# Altium project ControllerPCB.PrjPcb (part 1 of 2)
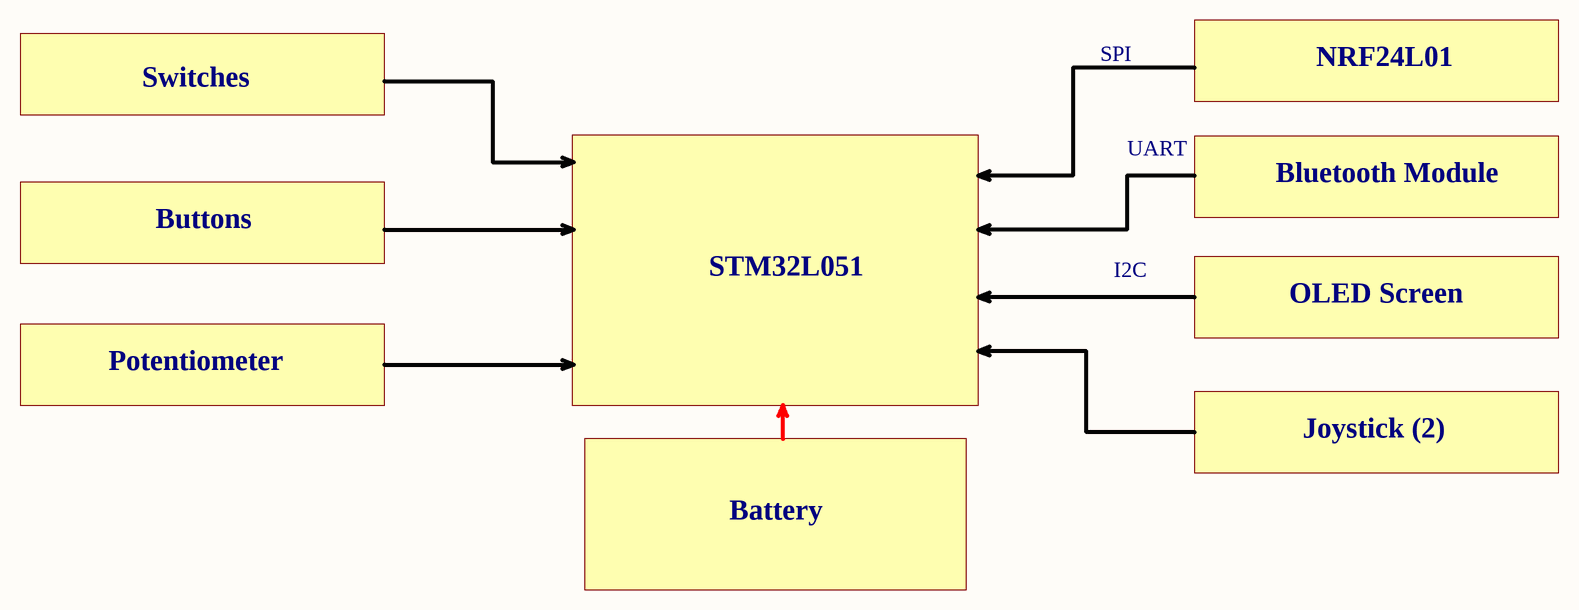
[diagram p0: Blok Diagram.SchDoc]
4 sheets, 79 parts. Net scope: flat (ports and power ports of the same name join across sheets).
Board files: ControllerPCB.PcbDoc, ControllerPCB2.PcbDoc
Sheets:
  Blok Diagram.SchDoc
  MCU.SchDoc
  Peripheral.SchDoc
  Power.SchDoc

## Sheet Blok Diagram.SchDoc
size A3; Date: 01/12/2021; DrawnBy: Can Güveren; Engineer: Can; SheetNumber: 1; SheetTotal: 4; PageSize: A3

### Notes on the sheet
- Switches
- SPI
- NRF24L01
- UART
- Buttons
- Bluetooth Module
- STM32L051
- I2C
- OLED Screen
- Potentiometer
- Joystick (2)
- Battery
- Project Name
- Draw By
- Date
- Size
- Number

## Sheet MCU.SchDoc
size A3; Date: 01/12/2021; DrawnBy: Can Güveren; SheetNumber: 2; SheetTotal: 4; PageSize: A3
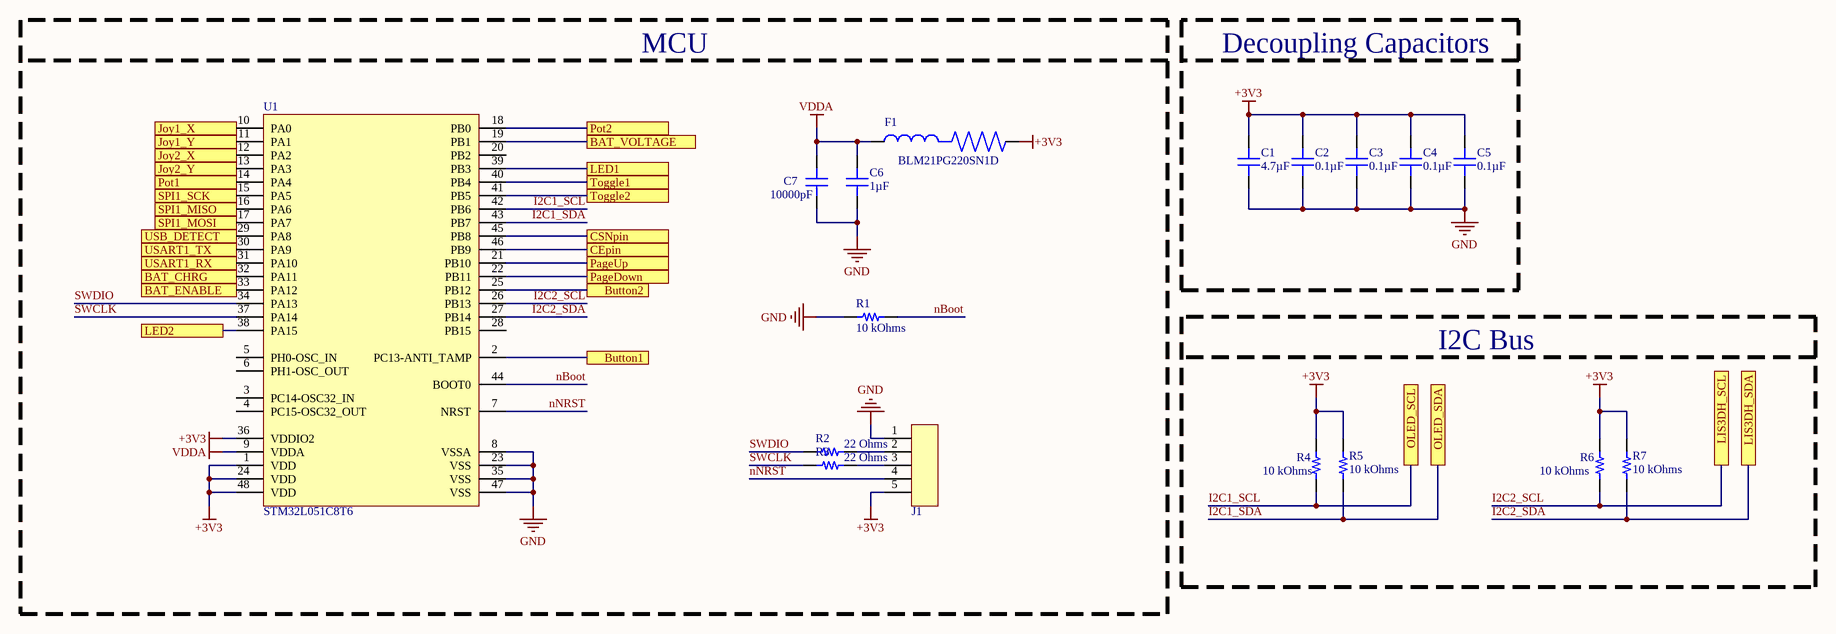
[diagram p1: MCU.SchDoc]

### Parts
C1  4.7µF  [CAP 0603_1608]
C2  0.1µF  [CAP 0603_1608]
C3  0.1µF  [CAP 0603_1608]
C4  0.1µF  [CAP 0603_1608]
C5  0.1µF  [CAP 0603_1608]
C6  1µF  [CAP 0603_1608]
C7  10000pF  [CAP 0603_1608]
F1  BLM21PG220SN1D  [BLM21PG220SN1D]
J1  Header-90 Degree-5x1  [Header-90 Degree-5P]  (value not drawn)
R1  10 kOhms  [RES 0603_1608]
R2  22 Ohms  [RES 0603_1608]
R3  22 Ohms  [RES 0603_1608]
R4  10 kOhms  [RES 0603_1608]
R5  10 kOhms  [RES 0603_1608]
R6  10 kOhms  [RES 0603_1608]
R7  10 kOhms  [RES 0603_1608]
U1  STM32L051C8T6  [LQFP-48]

### Blocks framed on the sheet
MCU: C6 C7 F1 J1 R1-R3 U1
Decoupling Capacitors: C1-C5
I2C Bus: R4-R7

### Ports
BAT_CHRG, BAT_ENABLE, BAT_VOLTAGE, Button1, Button2, CEpin, CSNpin, Joy1_X, Joy1_Y, Joy2_X, Joy2_Y, LED1, LED2, LIS3DH_SCL, LIS3DH_SDA, OLED_SCL, OLED_SDA, PageDown, PageUp, Pot1, Pot2, SPI1_MISO, SPI1_MOSI, SPI1_SCK, Toggle1, Toggle2, USART1_RX, USART1_TX, USB_DETECT

### Nets
+3V3: C1.2 C2.2 C3.2 C4.2 C5.2 F1.2 J1.5 R4.2 R5.2 R6.2 R7.2 U1.1(VDD) U1.24(VDD) U1.36(VDDIO2) U1.48(VDD)  [project net V_Output]
GND: C1.1 C2.1 C3.1 C4.1 C5.1 C6.1 C7.1 J1.1 R1.1 U1.8(VSSA) U1.23(VSS) U1.35(VSS) U1.47(VSS)
VDDA: C6.2 C7.2 F1.1 U1.9(VDDA)
I2C1_SCL: R4.1 U1.42(PB6) ; port OLED_SCL
I2C1_SDA: R5.1 U1.43(PB7) ; port OLED_SDA
I2C2_SCL: R6.1 U1.26(PB13) ; port LIS3DH_SCL
I2C2_SDA: R7.1 U1.27(PB14) ; port LIS3DH_SDA
nBoot: R1.2 U1.44(BOOT0)
nNRST: J1.4 U1.7(NRST)
SWCLK: R3.1 U1.37(PA14)
SWDIO: R2.1 U1.34(PA13)
NetC8_2: U1.21(PB10) ; port PageUp
NetC10_2: U1.22(PB11) ; port PageDown
NetC16_2: U1.29(PA8) ; port USB_DETECT
NetC19_2: U1.19(PB1) ; port BAT_VOLTAGE
NetH1_2: U1.31(PA10) ; port USART1_RX
NetH1_3: U1.30(PA9) ; port USART1_TX
NetJ1_2: J1.2 R2.2
NetJ1_3: J1.3 R3.2
NetJ2_H2: U1.11(PA1) ; port Joy1_Y
NetJ2_V2: U1.10(PA0) ; port Joy1_X
NetJ3_H2: U1.13(PA3) ; port Joy2_Y
NetJ3_V2: U1.12(PA2) ; port Joy2_X
NetR14_1: U1.39(PB3) ; port LED1
NetR15_1: U1.38(PA15) ; port LED2
NetR16_1: U1.32(PA11) ; port BAT_CHRG
NetR19_1: U1.33(PA12) ; port BAT_ENABLE
NetR28_1: U1.2(PC13-ANTI_TAMP) ; port Button1
NetR29_1: U1.25(PB12) ; port Button2
NetS1_2: U1.40(PB4) ; port Toggle1
NetS2_2: U1.41(PB5) ; port Toggle2
NetU1_14: U1.14(PA4) ; port Pot1
NetU1_15: U1.15(PA5) ; port SPI1_SCK
NetU1_16: U1.16(PA6) ; port SPI1_MISO
NetU1_17: U1.17(PA7) ; port SPI1_MOSI
NetU1_18: U1.18(PB0) ; port Pot2
NetU1_45: U1.45(PB8) ; port CSNpin
NetU1_46: U1.46(PB9) ; port CEpin

Not connected (* = marked no-connect by the designer): U1 3(PC14-OSC32_IN) 4(PC15-OSC32_OUT) 5(PH0-OSC_IN) 6(PH1-OSC_OUT) 20(PB2) 28(PB15)

### Notes on the sheet
- Project Name
- Draw By
- Date
- Size
- Number

### Library data of the parts
C1 = LMK107BJ475KA-T: CAP CER 4.7UF 10V X5R 0603; Manufacturer: Taiyo Yuden; Tolerance: ±10%; Part Number: LMK107BJ475KA-T; Value: 4.7µF; Applications: General Purpose; Capacitance: 4.7µF; ComponentLink1Description: Datasheet; ComponentLink1URL: https://ds.yuden.co.jp/TYCOMPAS/ut/detail?pn=LMK107BJ475KA-T  &u=M; ComponentLink2Description: DigiKey Link; ComponentLink2URL: http://digikey.com/product-detail/en/taiyo-yuden/LMK107BJ475KA-T/587-1441-1-ND/1004072; Device Package: 0603 (1608 Metric); LastUpdated: 2.09.2020 01:03:36; Lifecycle Status: Active; Minimum Order: 1; Mounting Type: Surface Mount, MLCC; Operating Temperature: -55°C ~ 85°C; Package / Case: 0603 (1608 Metric); Packaging: TapeAndReel; PartId: 2244; Part Status: Active; Price: 0.03; Series: M; Size / Dimension: 0.063" L x 0.031" W (1.60mm x 0.80mm); Supplier 1: DigiKey; Supplier Part Number 1: 587-1441-1-ND; Temperature Coefficient: X5R; Thickness (Max): 0.035" (0.90mm); Voltage - Rated: 10V
C2-C5 = 0603Y0160104KXT: CAP CER 0.10UF 16V X7R 0603; Manufacturer: Knowles Syfer; Temperature Coefficient: X7R (2R1); Tolerance: ±10%; Part Number: 0603Y0160104KXT; Value: 0.1µF; Applications: High Reliability, Boardflex Sensitive; Capacitance: 0.1µF; ComponentLink1Description: Datasheet; ComponentLink1URL: https://www.knowlescapacitors.com/getattachment/2dbfc8bc-e2b3-4b4d-afb1-43b011b9ebe0/High-Std-Voltage.aspx; ComponentLink2Description: DigiKey Link; ComponentLink2URL: http://digikey.com/product-detail/en/knowles-syfer/0603Y0160104KXT/1608-1363-1-ND/7644465; Device Package: 0603 (1608 Metric); Features: Soft Termination, High Temperature; LastUpdated: 2.09.2020 01:03:34; Lifecycle Status: Active; Minimum Order: 1; Mounting Type: Surface Mount, MLCC; Operating Temperature: -55°C ~ 125°C; Package / Case: 0603 (1608 Metric); Packaging: TapeAndReel; PartId: 2921; Part Status: Active; Price: 0.16; Series: FlexiCap™; Size / Dimension: 0.063" L x 0.031" W (1.60mm x 0.80mm); Supplier 1: DigiKey; Supplier Part Number 1: 1608-1363-1-ND; Thickness (Max): 0.031" (0.80mm); Voltage - Rated: 16V
C6 = C0603C105K4RACAUTO: CAP CER 0603 1UF 16V X7R 10%; Manufacturer: KEMET; Part Number: C0603C105K4RACAUTO; Value: 1µF; Applications: Automotive, Bypass, Decoupling; Capacitance: 1µF; ComponentLink1Description: Datasheet; ComponentLink1URL: https://api.kemet.com/component-edge/download/datasheet/C0603C105K4RACAUTO.pdf; ComponentLink2Description: DigiKey Link; ComponentLink2URL: http://digikey.com/product-detail/en/kemet/C0603C105K4RACAUTO/399-17704-1-ND/8635855; Device Package: 0603 (1608 Metric); LastUpdated: 2.09.2020 01:03:36; Lifecycle Status: Active; Minimum Order: 1; Mounting Type: Surface Mount, MLCC; Operating Temperature: -55°C ~ 125°C; Package / Case: 0603 (1608 Metric); Packaging: TapeAndReel; PartId: 2179; Part Status: Active; Price: 0.02; Ratings: AEC-Q200; Series: SMD Auto X7R; Size / Dimension: 0.063" L x 0.031" W (1.60mm x 0.80mm); Supplier 1: DigiKey; Supplier Part Number 1: 399-17704-1-ND; Temperature Coefficient: X7R; Thickness (Max): 0.037" (0.95mm); Tolerance: ±10%; Voltage - Rated: 16V
C7 = C0603C103K4RECAUTO: CAP CER 0603 10NF 16V X7R 10%; Manufacturer: KEMET; Part Number: C0603C103K4RECAUTO; Value: 10000pF; Applications: Automotive, ESD Protection; Capacitance: 10000pF; ComponentLink1Description: Datasheet; ComponentLink1URL: https://api.kemet.com/component-edge/download/datasheet/C0603C103K4RECAUTO.pdf; ComponentLink2Description: DigiKey Link; ComponentLink2URL: http://digikey.com/product-detail/en/kemet/C0603C103K4RECAUTO/399-17880-1-ND/8640547; Device Package: 0603 (1608 Metric); LastUpdated: 2.09.2020 01:03:25; Lifecycle Status: Active; Minimum Order: 1; Mounting Type: Surface Mount, MLCC; Operating Temperature: -55°C ~ 125°C; Package / Case: 0603 (1608 Metric); Packaging: TapeAndReel; PartId: 8251; Part Status: Active; Price: 0.02; Ratings: AEC-Q200; Series: ESD SMD Auto X7R; Size / Dimension: 0.063" L x 0.031" W (1.60mm x 0.80mm); Supplier 1: DigiKey; Supplier Part Number 1: 399-17880-1-ND; Temperature Coefficient: X7R; Thickness (Max): 0.034" (0.87mm); Tolerance: ±10%; Voltage - Rated: 16V
F1 = BLM21PG220SN1D: Ferrite Beads Multi-Layer 22Ohm 25% 100MHz 6A 9mOhm DCR 0805 Paper T/R; Manufacturer: Murata; Manufacturer Series: BLM21P; Material: Steel,Ferrite; Impedance: 22R; DC Resistance (DCR): 9mR; Shielding: Unshielded; Number of Circuits: 1; Resistance: 10mR; Supplier 1: Digi-Key; Manufacturer Part Number: BLM21PG220SN1D; RoHS: Yes; Category: Ferrite Beads and Chips; Pricing 1: 1=0,13000, 10=0,10300, 25=0,09320, 50=0,06820, 100=0,05890, 250=0,04652, 500=0,03930, 1000=0,03309 (USD); Case/Package: 0805; Number of Pins: 2; Core Material: Ferrite; Case Code (Metric): 2012; Case Code (Imperial): 0805; Weight: 0.000194oz; Terminal Finish: Tin; Min Operating Temperature: -55°C; Max Operating Temperature: 125°C; Tolerance: 25%; Packaging: Tape and Reel; Current Rating: 6A; Max DC Current: 6A; Number of Lines: 1; Package Quantity: 1; Max Current Rating: 6A; Termination: SMD/SMT; Test Frequency: 100MHz; DC Current: 6A; Series: BLM21P; DC Resistance-Max: 9mR; Number of Functions: 1; Length: 2mm; Width: 1.25mm; Height: 0.85mm; Depth: 1.25mm; Radiation Hardening: No; REACH SVHC: No SVHC; Lead Free: Lead Free; RoHS Compliant: Yes; ComponentLink1URL: https://datasheet.ciiva.com/14122/anblm21p-data-e-14122211.pdf?src-supplier=Distrelec; ComponentLink1Description: https://datasheet.ciiva.com/14122/anblm21p-data-e-14122211.pdf?src-supplier=Distrelec; ComponentLink2URL: https://datasheet.ciiva.com/11799/0900766b81275e31-11799177.pdf?src-supplier=RSComponents; ComponentLink2Description: https://datasheet.ciiva.com/11799/0900766b81275e31-11799177.pdf?src-supplier=RSComponents; ComponentLink3URL: https://datasheet.ciiva.com/29700/1845312-29700540.pdf?src-supplier=Jameco; ComponentLink3Description: https://datasheet.ciiva.com/29700/1845312-29700540.pdf?src-supplier=Jameco; ComponentLink4URL: https://datasheet.ciiva.com/3081/l0110s0100blm21p-3081653.pdf?src-supplier=Avnet; ComponentLink4Description: https://datasheet.ciiva.com/3081/l0110s0100blm21p-3081653.pdf?src-supplier=Avnet; ComponentLink5URL: https://datasheet.ciiva.com/8021/5160-8021589.pdf?src-supplier=Element14; ComponentLink5Description: https://datasheet.ciiva.com/8021/5160-8021589.pdf?src-supplier=Element14; ComponentLink6URL: https://datasheet.ciiva.com/16291/l0110s0100blm21p-16291622.pdf?src-supplier=Future+Electronics; ComponentLink6Description: https://datasheet.ciiva.com/16291/l0110s0100blm21p-16291622.pdf?src-supplier=Future+Electronics; ComponentLink7URL: https://datasheet.ciiva.com/8021/5160-8021591.pdf?src-supplier=Element14; ComponentLink7Description: https://datasheet.ciiva.com/8021/5160-8021591.pdf?src-supplier=Element14; ComponentLink8URL: https://datasheet.ciiva.com/6211/l0110s0100blm21p-6211741.pdf?src-supplier=Digi-Key; ComponentLink8Description: https://datasheet.ciiva.com/6211/l0110s0100blm21p-6211741.pdf?src-supplier=Digi-Key; ComponentLink9URL: https://datasheet.ciiva.com/41449/001171738-da-01-en-chip-drossel0805-22r0-6000ma-2-0x1-25mm-41449366.pdf?src-supplier=Conrad; ComponentLink9Description: https://datasheet.ciiva.com/41449/001171738-da-01-en-chip-drossel0805-22r0-6000ma-2-0x1-25mm-41449366.pdf?src-supplier=Conrad; Supplier Part Number 1: 490-5987-6-ND
R1 R4-R7 = RNCS0603BKE10K0: RES 10K OHM 0.1% 1/16W 0603; Manufacturer: Stackpole Electronics Inc; Power (Watts): 0.063W, 1/16W; Temperature Coefficient: ±25ppm/°C; Part Number: RNCS0603BKE10K0; Value: 10 kOhms; ComponentLink1Description: Datasheet; ComponentLink1URL: https://www.seielect.com/catalog/sei-rncs_rnch.pdf; ComponentLink2Description: DigiKey Link; ComponentLink2URL: http://digikey.com/product-detail/en/stackpole-electronics-inc/RNCS0603BKE10K0/RNCS0603BKE10K0CT-ND/1800113; Composition: Thin Film; Device Package: 0603 (1608 Metric); Features: Anti-Corrosive, Automotive AEC-Q200, Moisture Resistant; Height - Seated (Max): 0.022" (0.55mm); LastUpdated: 2.09.2020 01:10:25; Lifecycle Status: Active; Minimum Order: 1; Number of Terminations: 2; Operating Temperature: -55°C ~ 155°C; Package / Case: 0603 (1608 Metric); Packaging: TapeAndReel; PartId: 4838; Part Status: Active; Price: 0.08; Ratings: AEC-Q200; Resistance: 10 kOhms; Series: RNCS; Size / Dimension: 0.061" L x 0.031" W (1.55mm x 0.80mm); Supplier 1: DigiKey; Supplier Part Number 1: RNCS0603BKE10K0CT-ND; Supplier Device Package: 0603; Tolerance: ±0.1%
R2 R3 = ERJ-3EKF22R0V: RES SMD 22 OHM 1% 1/10W 0603; Manufacturer: Panasonic Electronic Components; Power (Watts): 0.1W, 1/10W; Temperature Coefficient: ±100ppm/°C; Part Number: ERJ-3EKF22R0V; Value: 22 Ohms; ComponentLink1Description: Datasheet; ComponentLink1URL: https://industrial.panasonic.com/cdbs/www-data/pdf/RDA0000/AOA0000C304.pdf; ComponentLink2Description: DigiKey Link; ComponentLink2URL: http://digikey.com/product-detail/en/panasonic-electronic-components/ERJ-3EKF22R0V/P22.0HCT-ND/1746745; Composition: Thick Film; Device Package: 0603 (1608 Metric); Features: Automotive AEC-Q200; Height - Seated (Max): 0.022" (0.55mm); LastUpdated: 2.09.2020 01:10:23; Lifecycle Status: Active; Minimum Order: 1; Number of Terminations: 2; Operating Temperature: -55°C ~ 155°C; Package / Case: 0603 (1608 Metric); Packaging: TapeAndReel; PartId: 5655; Part Status: Active; Price: 0.01; Ratings: AEC-Q200; Resistance: 22 Ohms; Series: ERJ; Size / Dimension: 0.063" L x 0.031" W (1.60mm x 0.80mm); Supplier 1: DigiKey; Supplier Part Number 1: P22.0HCT-ND; Supplier Device Package: 0603; Tolerance: ±1%
U1 = STM32L051C8T6: MCU 32-Bit Ultra Low Power STM32L ARM Cortex M0+ RISC 64kB Flash 48-Pin LQFP Tray; Manufacturer: STMicroelectronics; Max Power Dissipation: 363mW; Interface: I2C,SPI,IrDA,UART,USART,I2S; Number of I/Os: 37; Number of Timers/Counters: 5; RAM Size: 8KB; Frequency: 32MHz; Oscillator Type: Internal; Max Supply Voltage: 3.6V; Data Bus Width: 32b; Watchdog Timer: Yes; Peripherals: Brown-out Detect/Reset,POR,PWM,WDT,DMA; Supplier 1: Digi-Key; Manufacturer Part Number: STM32L051C8T6; RoHS: Yes; Category: Microcontrollers; Pricing 1: 1=4,40000, 10=3,95400, 25=3,73840, 80=3,24000, 250=3,07380, 500=2,76920 (USD); Case/Package: LQFP; Number of Pins: 48; Min Operating Temperature: -40°C; Max Operating Temperature: 85°C; Packaging: Tray; Number of Programmable I/O: 37; Max Frequency: 32MHz; Memory Type: FLASH; Memory Size: 64KB; Core Architecture: ARM; REACH SVHC: No SVHC; Lead Free: Lead Free; RoHS Compliant: Yes; ComponentLink1URL: https://datasheet.ciiva.com/48492/dm00108219-48492460.pdf?src-supplier=Avnet; ComponentLink1Description: https://datasheet.ciiva.com/48492/dm00108219-48492460.pdf?src-supplier=Avnet; Supplier Part Number 1: 497-14900-ND

## Sheet Peripheral.SchDoc
size A3; Date: 01/12/2021; DrawnBy: Can Güveren; SheetNumber: 3; SheetTotal: 4; PageSize: A3
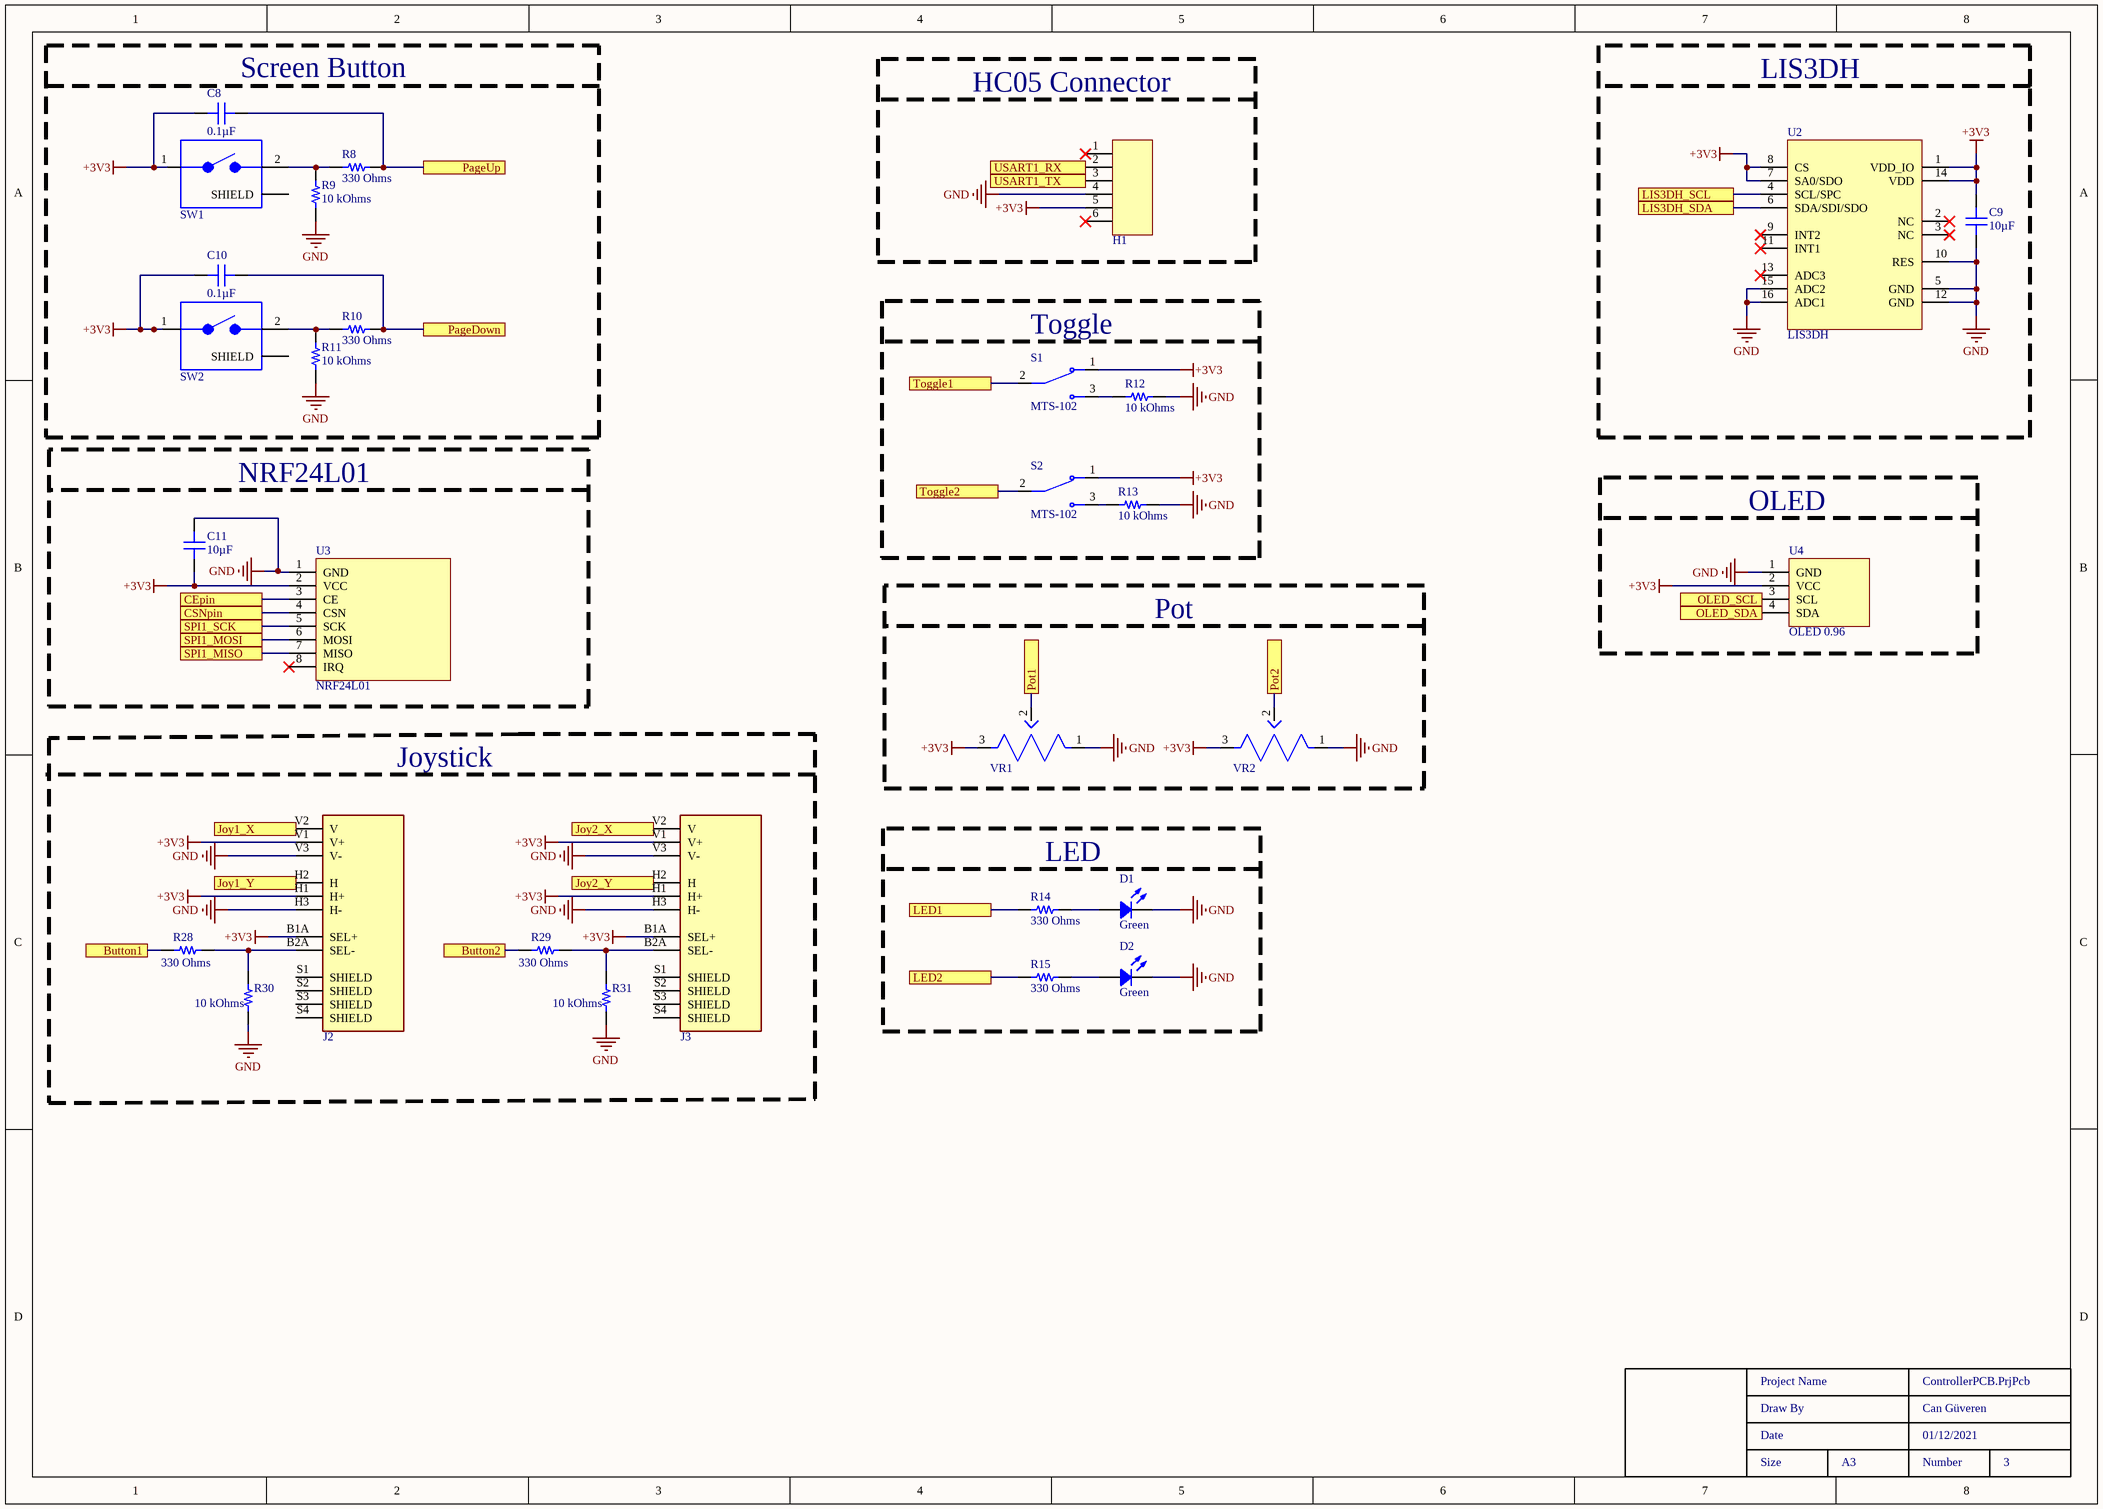
[diagram p2: Peripheral.SchDoc]

### Parts
C8  0.1µF  [CAP 0603_1608]
C9  10µF  [CAP 0603_1608]
C10  0.1µF  [CAP 0603_1608]
C11  10µF  [CAP 0603_1608]
D1  Green  [LED 1206_3216 YELLOW]
D2  Green  [LED 1206_3216 YELLOW]
H1  1x6 Pin Header - Female  [1x6 Pin Header - Female]  (value not drawn)
J2  COM-09032  [COM-09032]  (value not drawn)
J3  COM-09032  [COM-09032]  (value not drawn)
R8  330 Ohms  [RES 0603_1608]
R9  10 kOhms  [RES 0603_1608]
R10  330 Ohms  [RES 0603_1608]
R11  10 kOhms  [RES 0603_1608]
R12  10 kOhms  [RES 0603_1608]
R13  10 kOhms  [RES 0603_1608]
R14  330 Ohms  [RES 0603_1608]
R15  330 Ohms  [RES 0603_1608]
R28  330 Ohms  [RES 0603_1608]
R29  330 Ohms  [RES 0603_1608]
R30  10 kOhms  [RES 0603_1608]
R31  10 kOhms  [RES 0603_1608]
S1  MTS-102  [MTS-102 (Toggle)]
S2  MTS-102  [MTS-102 (Toggle)]
SW1  Switch Tactile, Right Angle  [Tactile Switch]  (value not drawn)
SW2  Switch Tactile, Right Angle  [Tactile Switch]  (value not drawn)
U2  LIS3DH  [VFLGA-16]
U3  NRF24L01  [NRF24L01+ PCB]
U4  OLED 0.96  [OLED 0.96]
VR1  PTV09A-4225F-B104  [PTV09A-4225F-B104]  (value not drawn)
VR2  PTV09A-4225F-B104  [PTV09A-4225F-B104]  (value not drawn)

### Blocks framed on the sheet
Screen Button: C8 C10 R8-R11 SW1 SW2
HC05 Connector: H1
LIS3DH: C9 U2
Toggle: R12 R13 S1 S2
NRF24L01: C11 U3
OLED: U4
Pot: VR1 VR2
Joystick: J2 J3 R28-R31
LED: D1 D2 R14 R15

### Ports
Button1, Button2, CEpin, CSNpin, Joy1_X, Joy1_Y, Joy2_X, Joy2_Y, LED1, LED2, LIS3DH_SCL, LIS3DH_SDA, OLED_SCL, OLED_SDA, PageDown, PageUp, Pot1, Pot2, SPI1_MISO, SPI1_MOSI, SPI1_SCK, Toggle1, Toggle2, USART1_RX, USART1_TX

### Nets
+3V3: C8.1 C9.2 C10.1 C11.1 H1.5 J2.B1A(SEL+) J2.H1(H+) J2.V1(V+) J3.B1A(SEL+) J3.H1(H+) J3.V1(V+) S1.1 S2.1 SW1.1 SW2.1 U2.1(VDD_IO) U2.7(SA0/SDO) U2.8(CS) U2.14(VDD) U3.2(VCC) U4.2(VCC) VR1.3 VR2.3  [project net V_Output]
GND: C9.1 C11.2 D1.2 D2.2 H1.4 J2.H3(H-) J2.V3(V-) J3.H3(H-) J3.V3(V-) R9.1 R11.1 R12.1 R13.1 R30.1 R31.1 U2.5(GND) U2.10(RES) U2.12(GND) U2.15(ADC2) U2.16(ADC1) U3.1(GND) U4.1(GND) VR1.1 VR2.1
I2C1_SCL: U4.3(SCL) ; port OLED_SCL
I2C1_SDA: U4.4(SDA) ; port OLED_SDA
I2C2_SCL: U2.4(SCL/SPC) ; port LIS3DH_SCL
I2C2_SDA: U2.6(SDA/SDI/SDO) ; port LIS3DH_SDA
NetC8_2: C8.2 R8.2 ; port PageUp
NetC10_2: C10.2 R10.2 ; port PageDown
NetD1_1: D1.1 R14.2
NetD2_1: D2.1 R15.2
NetH1_2: H1.2 ; port USART1_RX
NetH1_3: H1.3 ; port USART1_TX
NetJ2_B2A: J2.B2A(SEL-) R28.2 R30.2
NetJ2_H2: J2.H2(H) ; port Joy1_Y
NetJ2_V2: J2.V2(V) ; port Joy1_X
NetJ3_B2A: J3.B2A(SEL-) R29.2 R31.2
NetJ3_H2: J3.H2(H) ; port Joy2_Y
NetJ3_V2: J3.V2(V) ; port Joy2_X
NetR8_1: R8.1 R9.2 SW1.2
NetR10_1: R10.1 R11.2 SW2.2
NetR12_2: R12.2 S1.3
NetR13_2: R13.2 S2.3
NetR14_1: R14.1 ; port LED1
NetR15_1: R15.1 ; port LED2
NetR28_1: R28.1 ; port Button1
NetR29_1: R29.1 ; port Button2
NetS1_2: S1.2 ; port Toggle1
NetS2_2: S2.2 ; port Toggle2
NetSW1_S1: SW1.S1(SHIELD) SW1.S2(SHIELD)
NetSW2_S1: SW2.S1(SHIELD) SW2.S2(SHIELD)
NetU1_14: VR1.2 ; port Pot1
NetU1_15: U3.5(SCK) ; port SPI1_SCK
NetU1_16: U3.7(MISO) ; port SPI1_MISO
NetU1_17: U3.6(MOSI) ; port SPI1_MOSI
NetU1_18: VR2.2 ; port Pot2
NetU1_45: U3.4(CSN) ; port CSNpin
NetU1_46: U3.3(CE) ; port CEpin

Not connected (* = marked no-connect by the designer): H1 1(0)* 6(5)*; J2 S1(SHIELD) S2(SHIELD) S3(SHIELD) S4(SHIELD); J3 S1(SHIELD) S2(SHIELD) S3(SHIELD) S4(SHIELD); U2 2(NC)* 3(NC)* 9(INT2)* 11(INT1)* 13(ADC3)*; U3 8(IRQ)*

### Notes on the sheet
- Project Name
- Draw By
- Date
- Size
- Number

### Library data of the parts
C8 C10 = C0603C104K5RAC7411: CAP CER 0.1UF 50V X7R 0603; Manufacturer: KEMET; Tolerance: ±10%; Part Number: C0603C104K5RAC7411; Value: 0.1µF; Applications: Bypass, Decoupling; Capacitance: 0.1µF; ComponentLink1Description: Datasheet; ComponentLink1URL: https://api.kemet.com/component-edge/download/datasheet/C0603C104K5RAC7411.pdf; ComponentLink2Description: DigiKey Link; ComponentLink2URL: http://digikey.com/product-detail/en/kemet/C0603C104K5RAC7411/399-7374-2-ND/3317013; Device Package: 0603 (1608 Metric); LastUpdated: 2.09.2020 01:03:36; Lifecycle Status: Active; Minimum Order: 15000; Mounting Type: Surface Mount, MLCC; Operating Temperature: -55°C ~ 125°C; Package / Case: 0603 (1608 Metric); Packaging: TapeAndReel; PartId: 2233; Part Status: Active; Price: 0.02; Series: SMD Comm X7R; Size / Dimension: 0.063" L x 0.031" W (1.60mm x 0.80mm); Supplier 1: DigiKey; Supplier Part Number 1: 399-7374-2-ND; Temperature Coefficient: X7R; Thickness (Max): 0.035" (0.90mm); Voltage - Rated: 50V
C9 C11 = GRM188R60J106ME47D: CAP CER 10UF 6.3V X5R 0603; Manufacturer: Murata Electronics; Tolerance: ±20%; Part Number: GRM188R60J106ME47D; Value: 10µF; Applications: General Purpose; Capacitance: 10µF; ComponentLink1Description: Datasheet; ComponentLink1URL: https://www.murata.com/~/media/webrenewal/support/library/catalog/products/capacitor/mlcc/c02e.ashx?la=en-us; ComponentLink2Description: DigiKey Link; ComponentLink2URL: http://digikey.com/product-detail/en/murata-electronics/GRM188R60J106ME47D/490-3896-1-ND/965938; Device Package: 0603 (1608 Metric); LastUpdated: 2.09.2020 01:03:35; Lifecycle Status: Active; Minimum Order: 1; Mounting Type: Surface Mount, MLCC; Operating Temperature: -55°C ~ 85°C; Package / Case: 0603 (1608 Metric); Packaging: TapeAndReel; PartId: 2351; Part Status: Active; Price: 0.03; Series: GRM; Size / Dimension: 0.063" L x 0.031" W (1.60mm x 0.80mm); Supplier 1: DigiKey; Supplier Part Number 1: 490-3896-1-ND; Temperature Coefficient: X5R; Thickness (Max): 0.035" (0.90mm); Voltage - Rated: 6.3V
D1 D2 = 5990240007F: LED YELLOW 1206 SMD; Manufacturer: Dialight; Configuration: Standard; Current - Test: 20mA; Lens Color: 0.80mm; Lens Size: 2.00mm x 1.60mm; Lens Style: Rectangle with Flat Top; Millicandela Rating: 126mcd; Viewing Angle: 140°; Voltage - Forward (Vf) (Typ): 2.1V; Wavelength - Dominant: 590nm; Part Number: 5990240007F; Color: Yellow; ComponentLink1Description: Datasheet; ComponentLink1URL: http://www.dialightsignalsandcomponents.com/Assets/Brochures_And_Catalogs/Indication/CBI_SMD_new/Dialight_CBI_data_599-1206_Apr2018.pdf; ComponentLink2Description: DigiKey Link; ComponentLink2URL: http://digikey.com/product-detail/en/dialight/5990240007F/350-4363-1-ND/9385469; Device Package: 1206 (3216 Metric); Height (Max): 0.80mm; LastUpdated: 2.09.2020 01:21:26; Lifecycle Status: Active; Minimum Order: 1; Mounting Type: Surface Mount; Package / Case: 1206 (3216 Metric); Packaging: TapeAndReel; PartId: 1; Part Status: Active; Price: 0.07; Series: 599; Size / Dimension: 3.20mm L x 1.60mm W; Supplier 1: DigiKey; Supplier Part Number 1: 350-4363-1-ND; Supplier Device Package: 1206; Value: Green
J2 J3 = COM-09032: Joystick 10K Ohm 2 Axis Th; Manufacturer: SparkFun; Supplier 1: Digi-Key; Manufacturer Part Number: COM-09032; RoHS: No; Stock 1: 1930; Pricing 1: 1=3,95000 (USD); ComponentLink1URL: https://media.digikey.com/pdf/Data%20Sheets/Sparkfun%20PDFs/COM-09032_Web.pdf?src-supplier=Digi-Key; ComponentLink1Description: https://media.digikey.com/pdf/Data%20Sheets/Sparkfun%20PDFs/COM-09032_Web.pdf?src-supplier=Digi-Key; Supplier Part Number 1: 1568-1526-ND
R8 R10 R14 R15 R28 R29 = AC0603FR-07330RL: RES SMD 330 OHM 1% 1/10W 0603; Manufacturer: Yageo; Power (Watts): 0.1W, 1/10W; Temperature Coefficient: ±100ppm/°C; Part Number: AC0603FR-07330RL; Value: 330 Ohms; ComponentLink1Description: Datasheet; ComponentLink1URL: https://www.yageo.com/upload/media/product/productsearch/datasheet/rchip/PYu-AC_51_RoHS_L_7.pdf; ComponentLink2Description: DigiKey Link; ComponentLink2URL: http://digikey.com/product-detail/en/yageo/AC0603FR-07330RL/YAG3595CT-ND/6006444; Composition: Thick Film; Device Package: 0603 (1608 Metric); Features: Automotive AEC-Q200, Moisture Resistant; Height - Seated (Max): 0.022" (0.55mm); LastUpdated: 2.09.2020 01:09:46; Lifecycle Status: Active; Minimum Order: 1; Number of Terminations: 2; Operating Temperature: -55°C ~ 155°C; Package / Case: 0603 (1608 Metric); Packaging: CutTape; PartId: 22572; Part Status: Active; Price: 0.10; Ratings: AEC-Q200; Resistance: 330 Ohms; Series: AC; Size / Dimension: 0.063" L x 0.031" W (1.60mm x 0.80mm); Supplier 1: DigiKey; Supplier Part Number 1: YAG3595CT-ND; Supplier Device Package: 0603; Tolerance: ±1%
R9 R11-R13 R30 R31 = RNCS0603BKE10K0: as R1 on sheet MCU; Part Number: RNCS0603BKE10K0; Value: 10 kOhms; ComponentLink1Description: Datasheet; ComponentLink1URL: https://www.seielect.com/catalog/sei-rncs_rnch.pdf; ComponentLink2Description: DigiKey Link; ComponentLink2URL: http://digikey.com/product-detail/en/stackpole-electronics-inc/RNCS0603BKE10K0/RNCS0603BKE10K0CT-ND/1800113; Composition: Thin Film; Device Package: 0603 (1608 Metric); Features: Anti-Corrosive, Automotive AEC-Q200, Moisture Resistant; Height - Seated (Max): 0.022" (0.55mm); LastUpdated: 2.09.2020 01:10:25; Lifecycle Status: Active; Minimum Order: 1; Number of Terminations: 2; Operating Temperature: -55°C ~ 155°C; Package / Case: 0603 (1608 Metric); Packaging: TapeAndReel; PartId: 4838; Part Status: Active; Price: 0.08; Ratings: AEC-Q200; Resistance: 10 kOhms; Series: RNCS; Size / Dimension: 0.061" L x 0.031" W (1.55mm x 0.80mm); Supplier 1: DigiKey; Supplier Part Number 1: RNCS0603BKE10K0CT-ND; Supplier Device Package: 0603; Tolerance: ±0.1%
U2 = LIS3DH: MEMS digital output motion sensor ultra low-power high performance 3-axes "nano" accelerometer; Manufacturer: STMicroelectronics; Bandwidth: 5kHz; Interface: I2C,SPI; Axis: X, Y, Z; Sensor Type: 3 Axis; Min Supply Voltage: 1.71V; Max Supply Voltage: 3.6V; Resolution: 16b; Operating Supply Voltage: 2.5V; Operating Supply Current: 11uA; Supplier 1: Digi-Key; Manufacturer Part Number: LIS3DH; RoHS: Yes; Category: Accelerometers; Case/Package: LGA; Number of Pins: 16; Min Operating Temperature: -40°C; Max Operating Temperature: 85°C; Package Quantity: 490; Packaging: Tray; Output Type: Digital; Series: LIS3DH; Max Supply Voltage (DC): 3.6V; Min Supply Voltage (DC): 1.71V; Length: 3mm; Width: 3mm; Height: 1mm; Depth: 3mm; Radiation Hardening: No; Lead Free: Lead Free; REACH SVHC: No SVHC; RoHS Compliant: Yes; ComponentLink1URL: https://datasheet.ciiva.com/26928/lis3dh-26928591.pdf?src-supplier=IIIC; ComponentLink1Description: https://datasheet.ciiva.com/26928/lis3dh-26928591.pdf?src-supplier=IIIC; ComponentLink2URL: https://datasheet.ciiva.com/1166/1834384-1166167.pdf?src-supplier=Element14; ComponentLink2Description: https://datasheet.ciiva.com/1166/1834384-1166167.pdf?src-supplier=Element14; ComponentLink3URL: https://datasheet.ciiva.com/2810/cd00274221-2810007.pdf?src-supplier=Digi-Key; ComponentLink3Description: https://datasheet.ciiva.com/2810/cd00274221-2810007.pdf?src-supplier=Digi-Key; ComponentLink4URL: https://datasheet.ciiva.com/16638/cd00274221-16638201.pdf?src-supplier=Avnet+Europe; ComponentLink4Description: https://datasheet.ciiva.com/16638/cd00274221-16638201.pdf?src-supplier=Avnet+Europe; ComponentLink5URL: https://datasheet.ciiva.com/5296/cd00274221-470704-5296509.pdf?src-supplier=Mouser; ComponentLink5Description: https://datasheet.ciiva.com/5296/cd00274221-470704-5296509.pdf?src-supplier=Mouser; Supplier Part Number 1: 497-10610-ND
U3 = NRF24L01+ PCB
VR1 VR2 = PTV09A-4225F-B104: Res Carbon Film POT 100K Ohm 20% 1/20W 1(Elec)/1(Mech)Turn 6mm (11.4 X 12.65 X 28.8mm) Pin Bracket Mount/Through Hole; Manufacturer: Bourns; Resistance: 100kR; Number of Turns: 1; Max Power Dissipation: 50mW; Actuator Length: 0.984inch; Actuator Diameter: 0.236inch; Hole Diameter: 9.1mm; Supplier 1: Digi-Key; Manufacturer Part Number: PTV09A-4225F-B104; RoHS: Yes; Category: Variable Resistors and Potentiometers; Stock 1: 376; Pricing 1: 1=0,83000, 10=0,74400, 25=0,67200, 40=0,64800, 100=0,61200, 300=0,58800, 500=0,55200, 1000=0,45600, 4900=0,37200 (USD); Mount: Through Hole,Snap in,Brackets,Horizontal; Min Operating Temperature: -10°C; Max Operating Temperature: 50°C; Tolerance: 20%; Package Quantity: 100; Packaging: Bulk; Taper: Linear; Termination: Pin; Number of Gangs: 1; Resistor Type: Carbon; Type: Potentiometer; Series: Pro Audio PTV09; Technology: CARBON FILM; Power Rating: 50mW; Length: 11.4mm; Height: 12.5mm; Depth: 12.5mm; Radiation Hardening: No; RoHS Compliant: Yes; Military Standard: Not; REACH SVHC: No SVHC; ComponentLink1URL: https://datasheet.ciiva.com/6249/ptv09-6249573.pdf?src-supplier=Digi-Key; ComponentLink1Description: https://datasheet.ciiva.com/6249/ptv09-6249573.pdf?src-supplier=Digi-Key; Supplier Part Number 1: PTV09A-4225F-B104-ND
S1 S2 = MTS-102: ComponentLink1URL: https://datasheet.ciiva.com/24455/t111597-24455739.pdf?src-supplier=Onlinecomponents.com; ComponentLink1Description: https://datasheet.ciiva.com/24455/t111597-24455739.pdf?src-supplier=Onlinecomponents.com; ComponentLink2URL: https://datasheet.ciiva.com/2905/t111597-2905494.pdf?src-supplier=Digi-Key; ComponentLink2Description: https://datasheet.ciiva.com/2905/t111597-2905494.pdf?src-supplier=Digi-Key